# EAGLE schematic BoB Brain v02 (EAGLE 7.5.0)

## Sheet 1 of 2: LED Controller
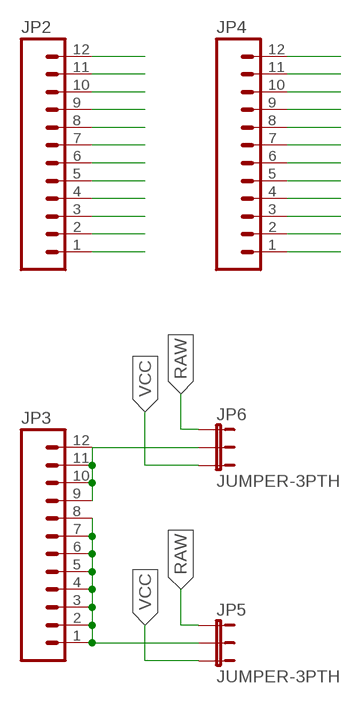
[diagram p0: schematic, sheet 1]

### Parts
JP2  M12PTH  [1X12]
JP3  M12PTH  [1X12]
JP4  M12PTH  [1X12]
JP5  JUMPER-3PTH  [1X03]
JP6  JUMPER-3PTH  [1X03]

### Nets
6V: JP3.9 JP3.10 JP3.11 JP3.12 JP6.2
GND: JP2.1 JP2.2 JP2.3 JP2.4 JP2.5 JP2.6 JP2.7 JP2.8 JP2.9 JP2.10 JP2.11 JP2.12 ; also sheet 2
N$7: JP4.12
N$10: JP4.11
N$16: JP4.10
N$17: JP4.9
N$18: JP4.8
N$19: JP4.7
N$20: JP4.6
N$21: JP4.5
N$22: JP4.4
N$23: JP4.3
N$24: JP4.2
N$25: JP4.1
PIN_PWR: JP3.1 JP3.2 JP3.3 JP3.4 JP3.5 JP3.6 JP3.7 JP3.8 JP5.2
RAW: JP5.1 JP6.1 ; also sheet 2
VCC: JP5.3 JP6.3 ; also sheet 2

## Sheet 2 of 2: My Arduino
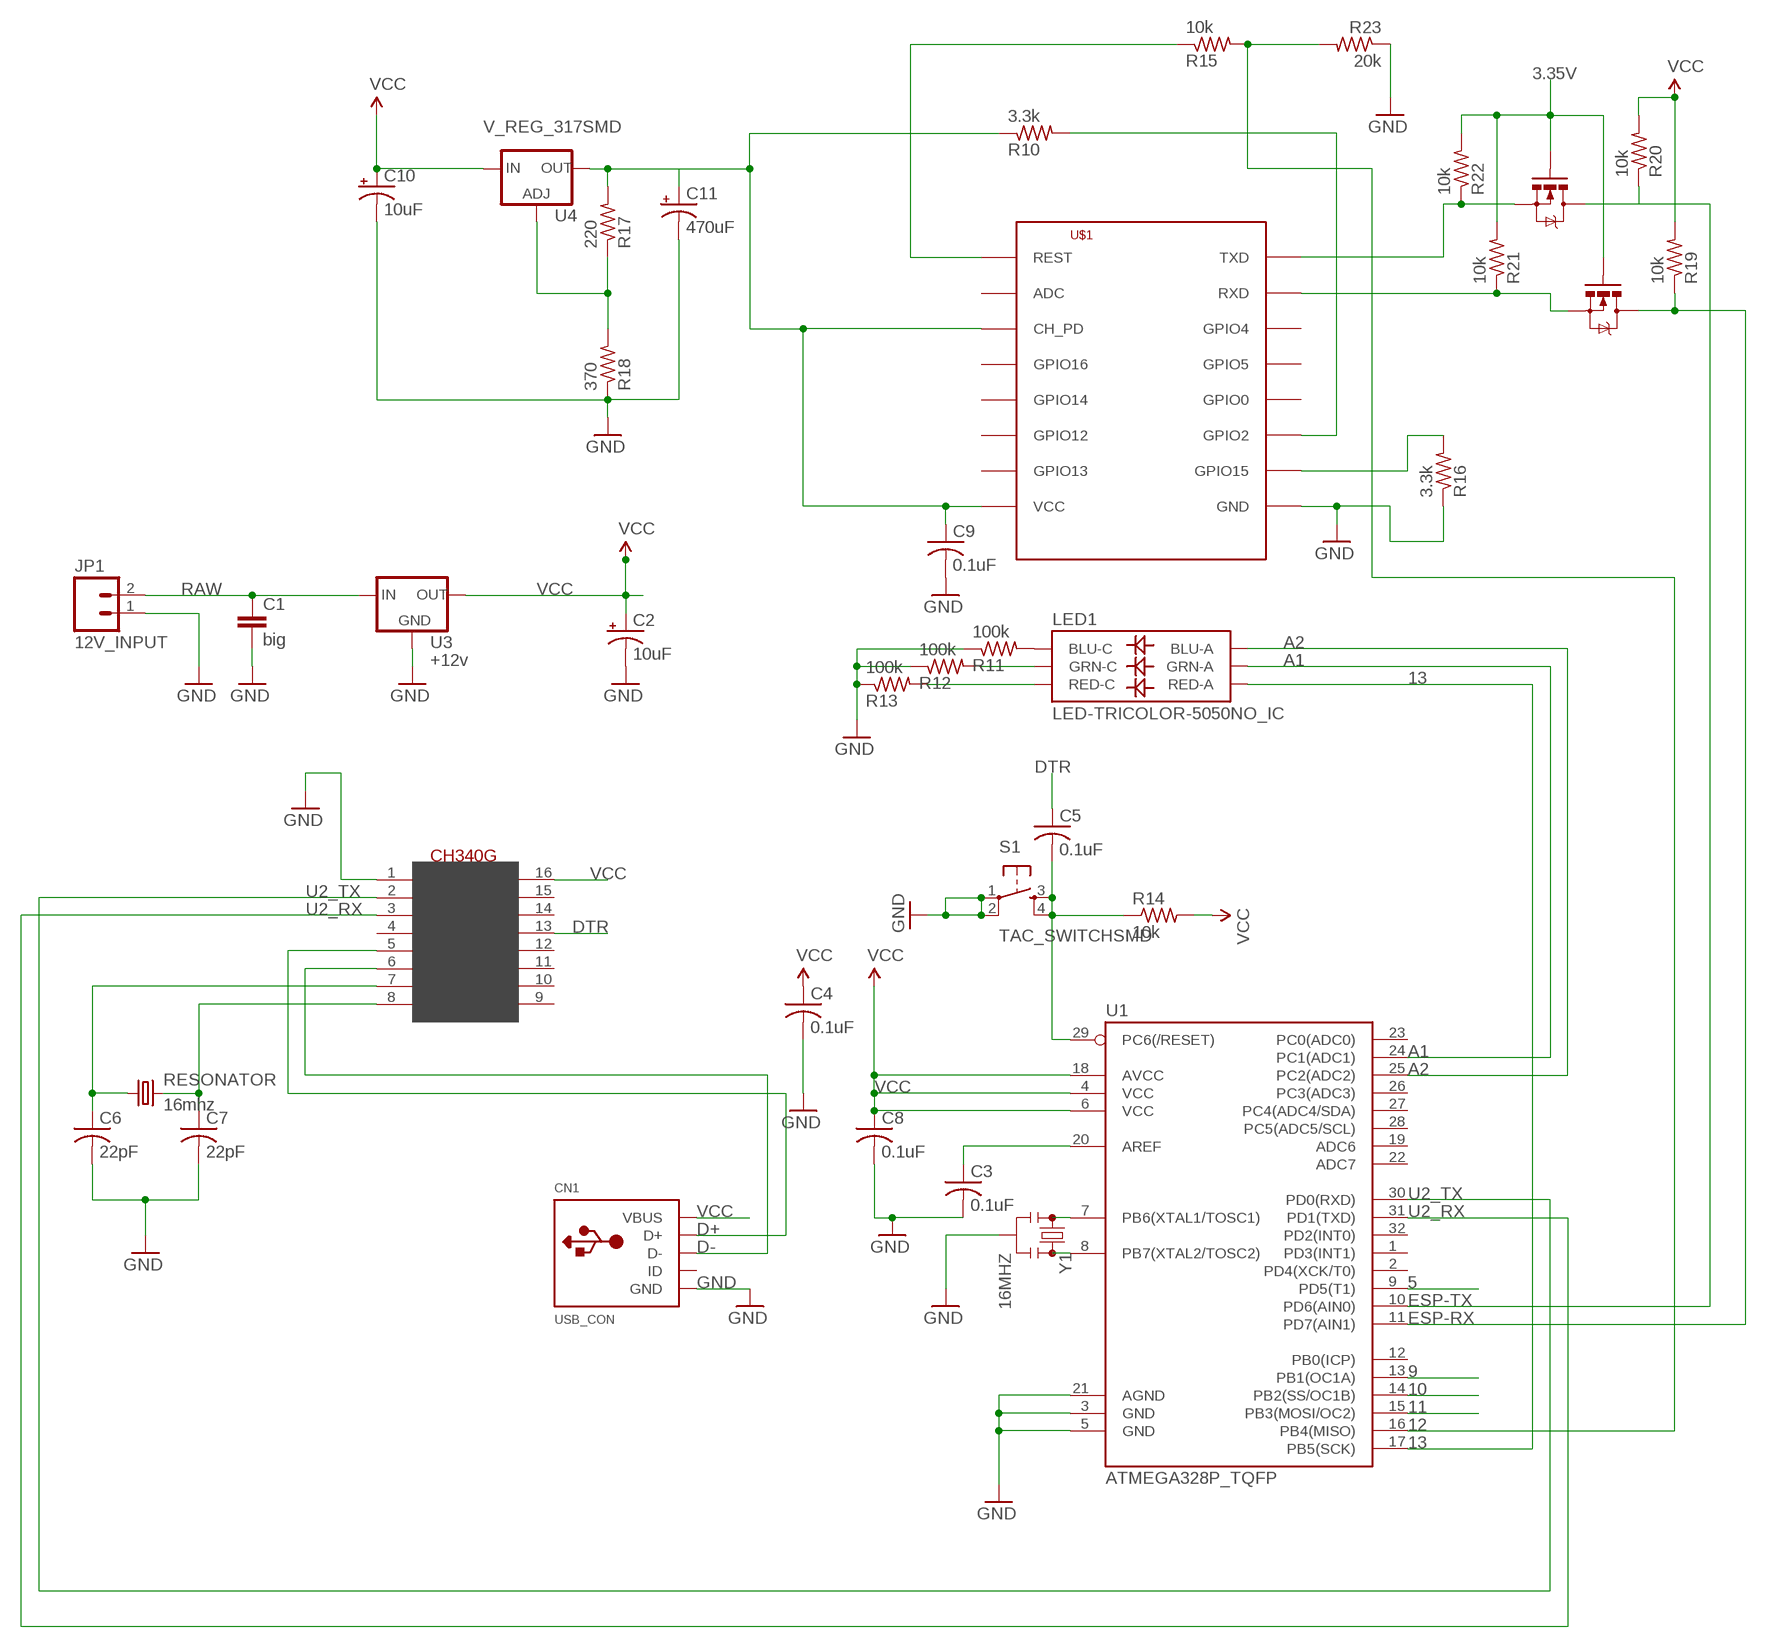
[diagram p1: schematic, sheet 2]

### Parts
C1  big  CAPPTH1  [CAP-PTH-5MM]
C2  10uF  CAP_POL3528  [EIA3528]
C3  0.1uF  C-USC0402  [C0402]
C4  0.1uF  C-USC0805K  [C0805K]
C5  0.1uF  C-USC0805K  [C0805K]
C6  22pF  C-USC0805K  [C0805K]
C7  22pF  C-USC0805K  [C0805K]
C8  0.1uF  C-USC0402  [C0402]
C9  0.1uF  C-USC0805K  [C0805K]
C10  10uF  CAP_POL3528  [EIA3528]
C11  470uF  CPOL-USD/7343-31W  [D/7343-31W]
CN1  USB_CON  USBMINIB  [USB-MINIB]
JP1  12V_INPUT  M025MM  [SCREWTERMINAL-5MM-2]
LED1  LED-TRICOLOR-5050NO_IC  [LED-TRICOLOR-5050]
Q1  MOSFET-NCHANNELAO3404A  [SOT23-3]
Q9  MOSFET-NCHANNELAO3404A  [SOT23-3]
R10  3.3k  R-US_R0805W  [R0805W]
R11  100k  R-US_R0805W  [R0805W]
R12  100k  R-US_R0805W  [R0805W]
R13  100k  R-US_R0805W  [R0805W]
R14  10k  R-US_R0805W  [R0805W]
R15  10k  R-US_R0805W  [R0805W]
R16  3.3k  R-US_R0805W  [R0805W]
R17  220  R-US_R0805W  [R0805W]
R18  370  R-US_R0805W  [R0805W]
R19  10k  R-US_R0805W  [R0805W]
R20  10k  R-US_R0805W  [R0805W]
R21  10k  R-US_R0805W  [R0805W]
R22  10k  R-US_R0805W  [R0805W]
R23  20k  R-US_R0805W  [R0805W]
RESONATOR  16mhz  CRYSTALHC49UP  [HC49UP]
S1  TAC_SWITCHSMD  [TACTILE-SWITCH-SMD]
U1  ATMEGA328P_TQFP  [TQFP32-08]
U2  CH340G  [SOIC16]
U3  +12v  V_REG_78XX7812  [TO-252]
U4  V_REG_317SMD  [SOT223]
U$1  ESP8266-07  [ESP-07]
Y1  16MHZ  RESONATOR16MHZ  [RESONATOR-SMD]

### Nets
3.35V: C9.1 C11.+ Q1.1(G) Q9.1(G) R10.1 R17.2 R21.2 R22.2 U4.2(OUT) U$1.CH_PD U$1.VCC
5: U1.9(PD5(T1))
9: U1.13(PB1(OC1A))
10: U1.14(PB2(SS/OC1B))
11: U1.15(PB3(MOSI/OC2))
12: R15.2 R23.2 U1.16(PB4(MISO))
13: LED1.2(RED-A) U1.17(PB5(SCK))
A1: LED1.1(GRN-A) U1.24(PC1(ADC1))
A2: LED1.3(BLU-A) U1.25(PC2(ADC2))
D+: CN1.D+ U2.5(D+)
D-: CN1.D- U2.6(D-)
DTR: C5.1 U2.13(DTR)
ESP-RX: Q9.3(D) R19.1 U1.11(PD7(AIN1))
ESP-TX: Q1.3(D) R20.1 U1.10(PD6(AIN0))
GND: C1.2 C2.C(-) C3.2 C4.2 C6.2 C7.2 C8.2 C9.2 C10.C(-) C11.- CN1.GND JP1.1 R11.1 R12.1 R13.1 R16.1 R18.1 R23.1 S1.1 S1.2 U1.3(GND) U1.5(GND) U1.21(AGND) U2.1(GND) U3.3(GND) U$1.GND Y1.2 ; also sheet 1
N$1: C3.1 U1.20(AREF)
N$2: U1.7(PB6(XTAL1/TOSC1)) Y1.1
N$3: R15.1 U$1.REST
N$4: R10.2 U$1.GPIO2
N$5: R16.2 U$1.GPIO15
N$6: LED1.4(BLU-C) R11.2
N$8: LED1.6(GRN-C) R12.2
N$9: LED1.5(RED-C) R13.2
N$11: U1.8(PB7(XTAL2/TOSC2)) Y1.3
N$12: Q1.2(S) R22.1 U$1.TXD
N$13: C5.2 R14.1 S1.3 S1.4 U1.29(PC6(/RESET))
N$14: R17.1 R18.2 U4.1(ADJ)
N$15: Q9.2(S) R21.1 U$1.RXD
RAW: C1.1 JP1.2 U3.1(IN) ; also sheet 1
U2_RX: U1.31(PD1(TXD)) U2.3(RX)
U2_TX: U1.30(PD0(RXD)) U2.2(TX)
VCC: C2.A(+) C4.1 C8.1 C10.A(+) CN1.VBUS R14.2 R19.2 R20.2 U1.4(VCC) U1.6(VCC) U1.18(AVCC) U2.16(VCC) U3.2(OUT) U4.3(IN) ; also sheet 1
X0: C7.1 RESONATOR.2 U2.8(XO)
X1: C6.1 RESONATOR.1 U2.7(XI)
Unconnected: CN1.ID U1.1(PD3(INT1)) U1.2(PD4(XCK/T0)) U1.12(PB0(ICP)) U1.19(ADC6) U1.22(ADC7) U1.23(PC0(ADC0)) U1.26(PC3(ADC3)) U1.27(PC4(ADC4/SDA)) U1.28(PC5(ADC5/SCL)) U1.32(PD2(INT0)) U2.4(V3) U2.9(CTS) U2.10(DSR) U2.11(RI) U2.12(DCD) U2.14(RTS) U2.15(RS232) U$1.ADC U$1.GPIO0 U$1.GPIO4 U$1.GPIO5 U$1.GPIO12 U$1.GPIO13 U$1.GPIO14 U$1.GPIO16

## Library data of the parts
C1 = SparkFun-Passives:CAP: Capacitor Standard 0603 ceramic capacitor, and 0.1" leaded capacitor.
C2 C10 = SparkFun-Capacitors:CAP_POL: Capacitor Polarized These are standard SMD and PTH capacitors. Normally 10uF, 47uF, and 100uF in electrolytic and tantalum varieties. Always verify the external diameter of the through hole cap, it varies with capacity, voltage, and manufacturer. The EIA devices should be standard.
C3-C9 = resistor:C-US: CAPACITOR, American symbol
C11 = resistor:CPOL-US: POLARIZED CAPACITOR, American symbol
CN1 = adafruit:USB: USB Connectors USBMINIB - Surface Mount Female Mini-B USB Connector 4UConnector: 06564 By microbuilder.eu Thru-hole RA Female Mini-B USB Connector 4UConnector: 18732 By ladyada.net
JP1 = SparkFun-Connectors:M02: Standard 2-pin 0.1" header. Use with - straight break away headers ( PRT-00116) - right angle break away headers (PRT-00553) - swiss pins (PRT-00743) - machine pins (PRT-00117) - female headers (PRT-00115) Molex polarized connector foot print use with: PRT-08233 with associated crimp pins and housings. 2.54_SCREWTERM for use with PRT-10571. 3.5mm Screw Terminal footprints for PRT-08084 5mm Screw Terminal footprints for use with PRT-08432; STOREFRONT_ID: PRT-08432
JP2-JP4 = SparkFun-Connectors:M12: Header 12 Standard 12-pin 0.1" header. Use with straight break away headers (SKU : PRT-00116), right angle break away headers (PRT-00553), swiss pins (PRT-00743), machine pins (PRT-00117), and female headers (PRT-00115).
JP5 JP6 = SparkFun-Retired:JUMPER-3
LED1 = SparkFun-LED:LED-TRICOLOR-5050
Q1 Q9 = SparkFun-DiscreteSemi:MOSFET-NCHANNEL: Common NMOSFET Parts MFG P/N Store ID Prod ID FDD8780 TRANS-09984 SI7820DN TRANS-11055 FDS6630A IC-08089 2N7002PW TRANS-11151 FQP30N06L COM-10213 TRANS-10060 BSS123LT1G TRANS-08345 BSS138 TRANS-00830 BS170 2N7000; PROD_ID: TRAN-12988
R10-R23 = resistor:R-US_: RESISTOR, American symbol
RESONATOR = crystal:CRYSTAL: CRYSTAL; OC_FARNELL: unknown; OC_NEWARK: unknown
S1 = SparkFun-Retired:TAC_SWITCH: Momentary Switch Button commonly used for reset or general input. Spark Fun Electronics SKU : COM-00097 SMT- SWCH-08247; PROD_ID: SWCH-08247
U1 = SparkFun-DigitalIC:ATMEGA328P_TQFP; PROD_ID: IC-09069
U2 = usb-serial:CH340G
U3 = SparkFun-PowerIC:V_REG_78XX: Voltage Regulator Standard 78xx regulator. IGO (Input Ground Output). Spark Fun Electronics SKU : COM-00107; PROD_ID: VREG-12370
U4 = SparkFun-PowerIC:V_REG_317: Voltage Regulator Standard LM317 adjustable voltage regulator. AOI (Adjust Output Input). Google 'LM317 Calculator' for easy to use app to get the two resistor values needed. 240/720 for 5V output. 240/390 for 3.3V output. Spark Fun Electronics SKU : COM-00527
U$1 = lio:ESP8266
Y1 = SparkFun-FreqCtrl:RESONATOR: Resonator Small SMD resonator. Used, eg, on the Arduino Pro/ Pro Mini boards. 8MHz- XTAL-08895 16MHz- XTAL-08900; PROD_ID: XTAL-08900